# EAGLE design WenzelBox (EAGLE 5.12)
AUTHOR: Tobin Fricke; COMPANY: Max-Planck-Institut für Gravitationsphysik; DATE: 2013-01-23; REVISION: 2013-01-23; TITLE: WENZELBOX

## Sheet 1 of 4
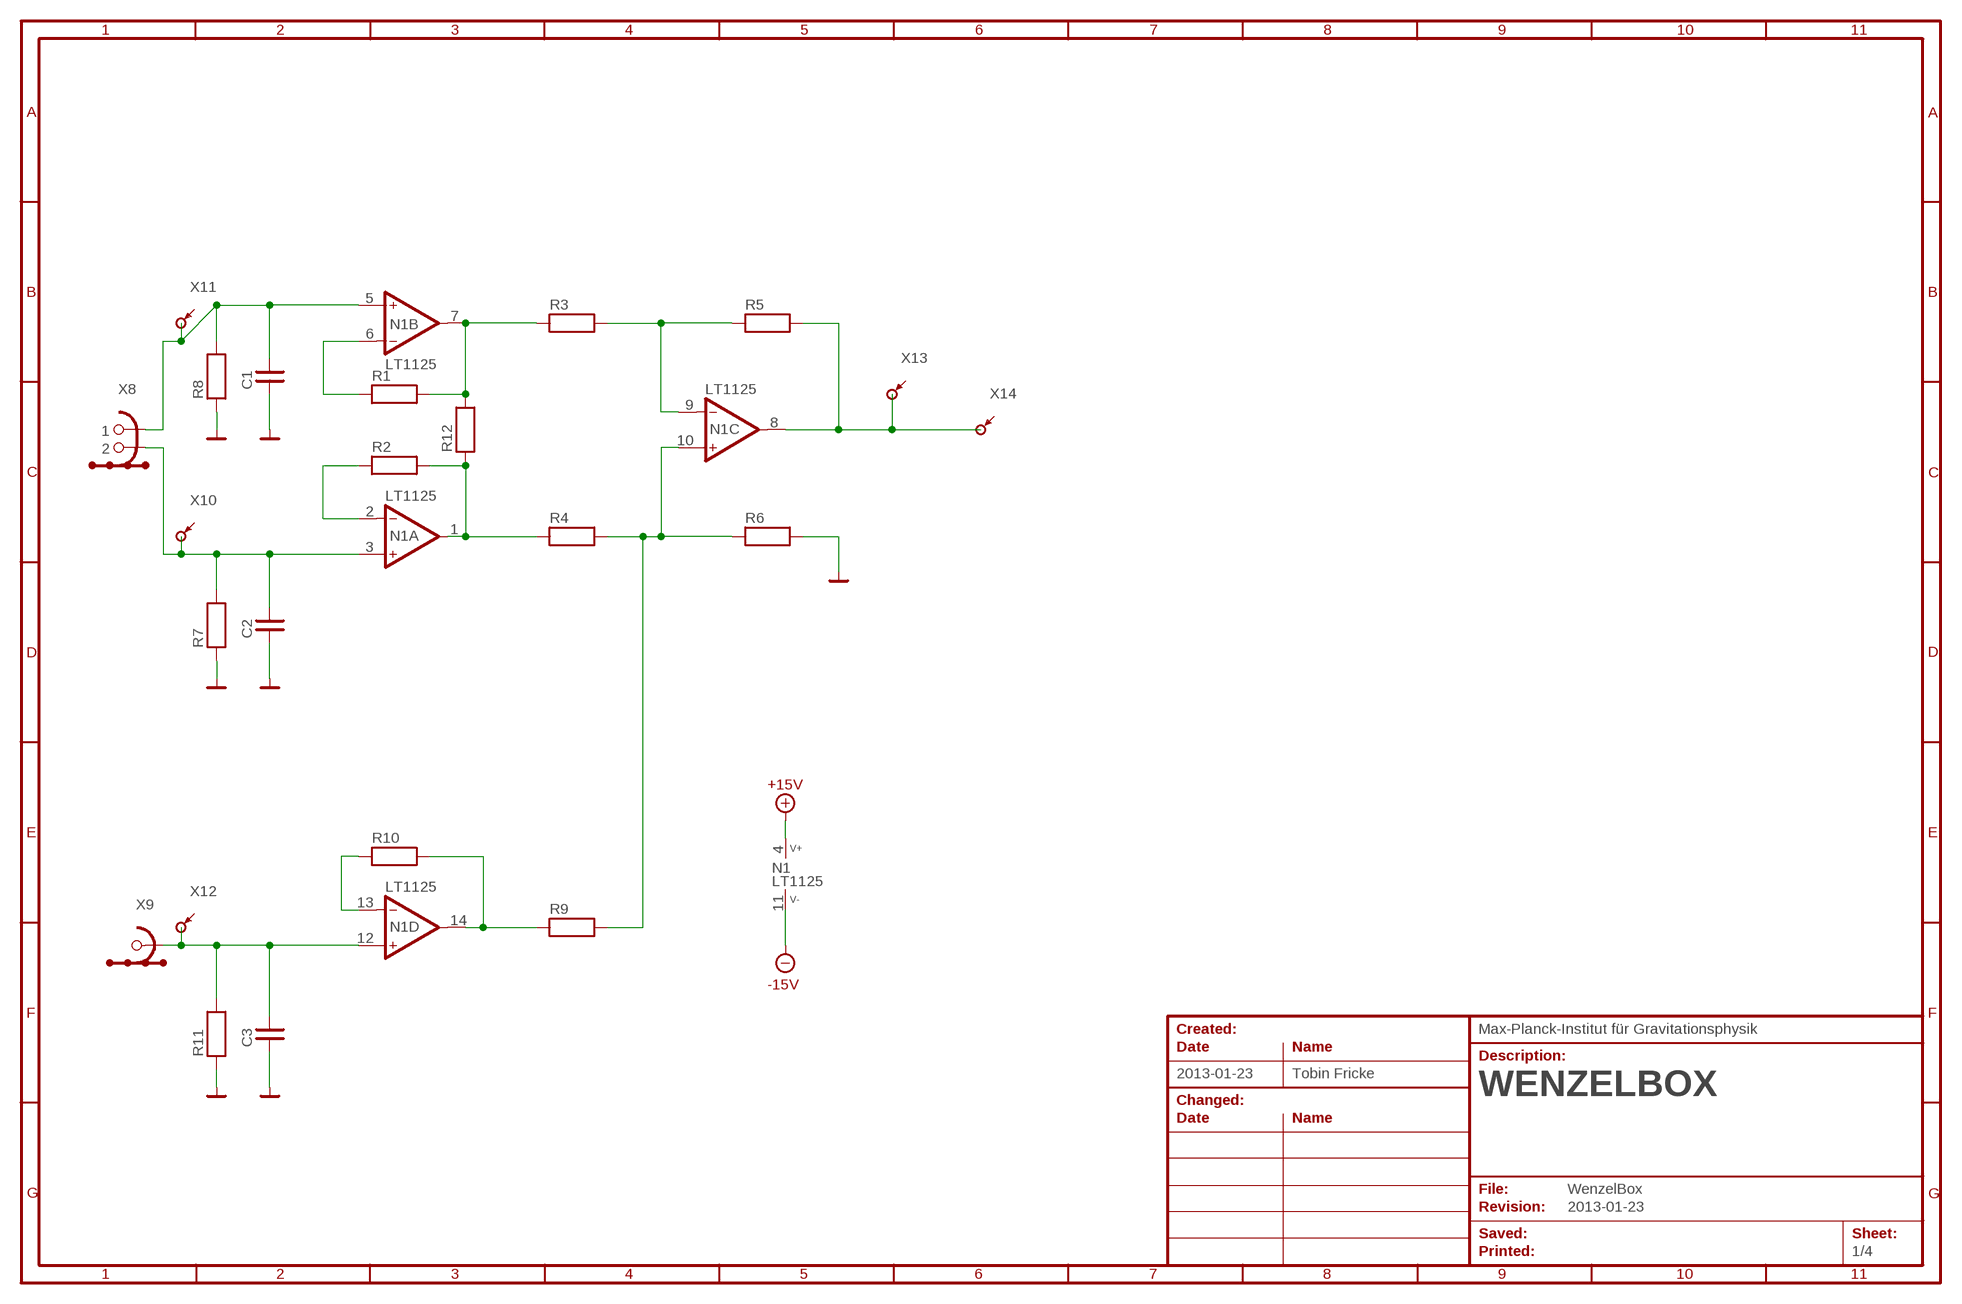
[diagram p0: schematic, sheet 1]
$2 (FRAME-A4-LANDSCAPE): SPICE: <ignore>

### Parts
C1  C  [C02N]
C2  C  [C02N]
C3  C  [C02N]
N1  LT1125  [DIP14L]
R1  R  [R04N]
R2  R  [R04N]
R3  R  [R04N]
R4  R  [R04N]
R5  R  [R04N]
R6  R  [R04N]
R7  R  [R04N]
R8  R  [R04N]
R9  R  [R04N]
R10  R  [R04N]
R11  R  [R04N]
R12  R  [R04N]
X8  XS02-4SN  [XS02-LEMO0B-HN]
X9  XS01-4S  [XS01-LEMO00-HN]
X10  XT-1.0METAL-N  [XT-1.0METAL-N]
X11  XT-1.0METAL-N  [XT-1.0METAL-N]
X12  XT-1.0METAL-N  [XT-1.0METAL-N]
X13  XT-1.0METAL-N  [XT-1.0METAL-N]
X14  XT-1.0METAL-N  [XT-1.0METAL-N]

### Nets
+15V: N1.4(P:V+) ; supply symbol labelled V+15V ; also sheet 4
-15V: N1.11(P:V-) ; supply symbol labelled V-15V ; also sheet 4
GND: C1.1 C2.1 C3.1 R6.2 R7.1 R8.1 R11.1 ; supply symbol labelled VG ; also sheet 4
N$4: N1.8(C:OUT) R5.2 X13.MP X14.MP
N$5: C1.2 N1.5(B:IN+) R8.2 X8.1 X11.MP
N$6: C2.2 N1.3(A:IN+) R7.2 X8.2 X10.MP
N$7: N1.2(A:IN-) R2.1
N$8: N1.1(A:OUT) R2.2 R4.1 R12.1
N$9: N1.7(B:OUT) R1.2 R3.1 R12.2
N$10: N1.6(B:IN-) R1.1
N$11: N1.14(D:OUT) R9.1 R10.2
N$13: N1.9(C:IN-) R3.2 R5.1
N$14: N1.10(C:IN+) R4.2 R6.1 R9.2
N$16: N1.13(D:IN-) R10.1
N$17: C3.2 N1.12(D:IN+) R11.2 X9.SIG X12.MP
Unconnected: X8.GND@1(GND) X8.GND@2(GND) X8.GND@3(GND) X8.GND@4(GND) X9.GND@1(GND) X9.GND@2(GND) X9.GND@3(GND) X9.GND@4(GND)

## Sheet 2 of 4
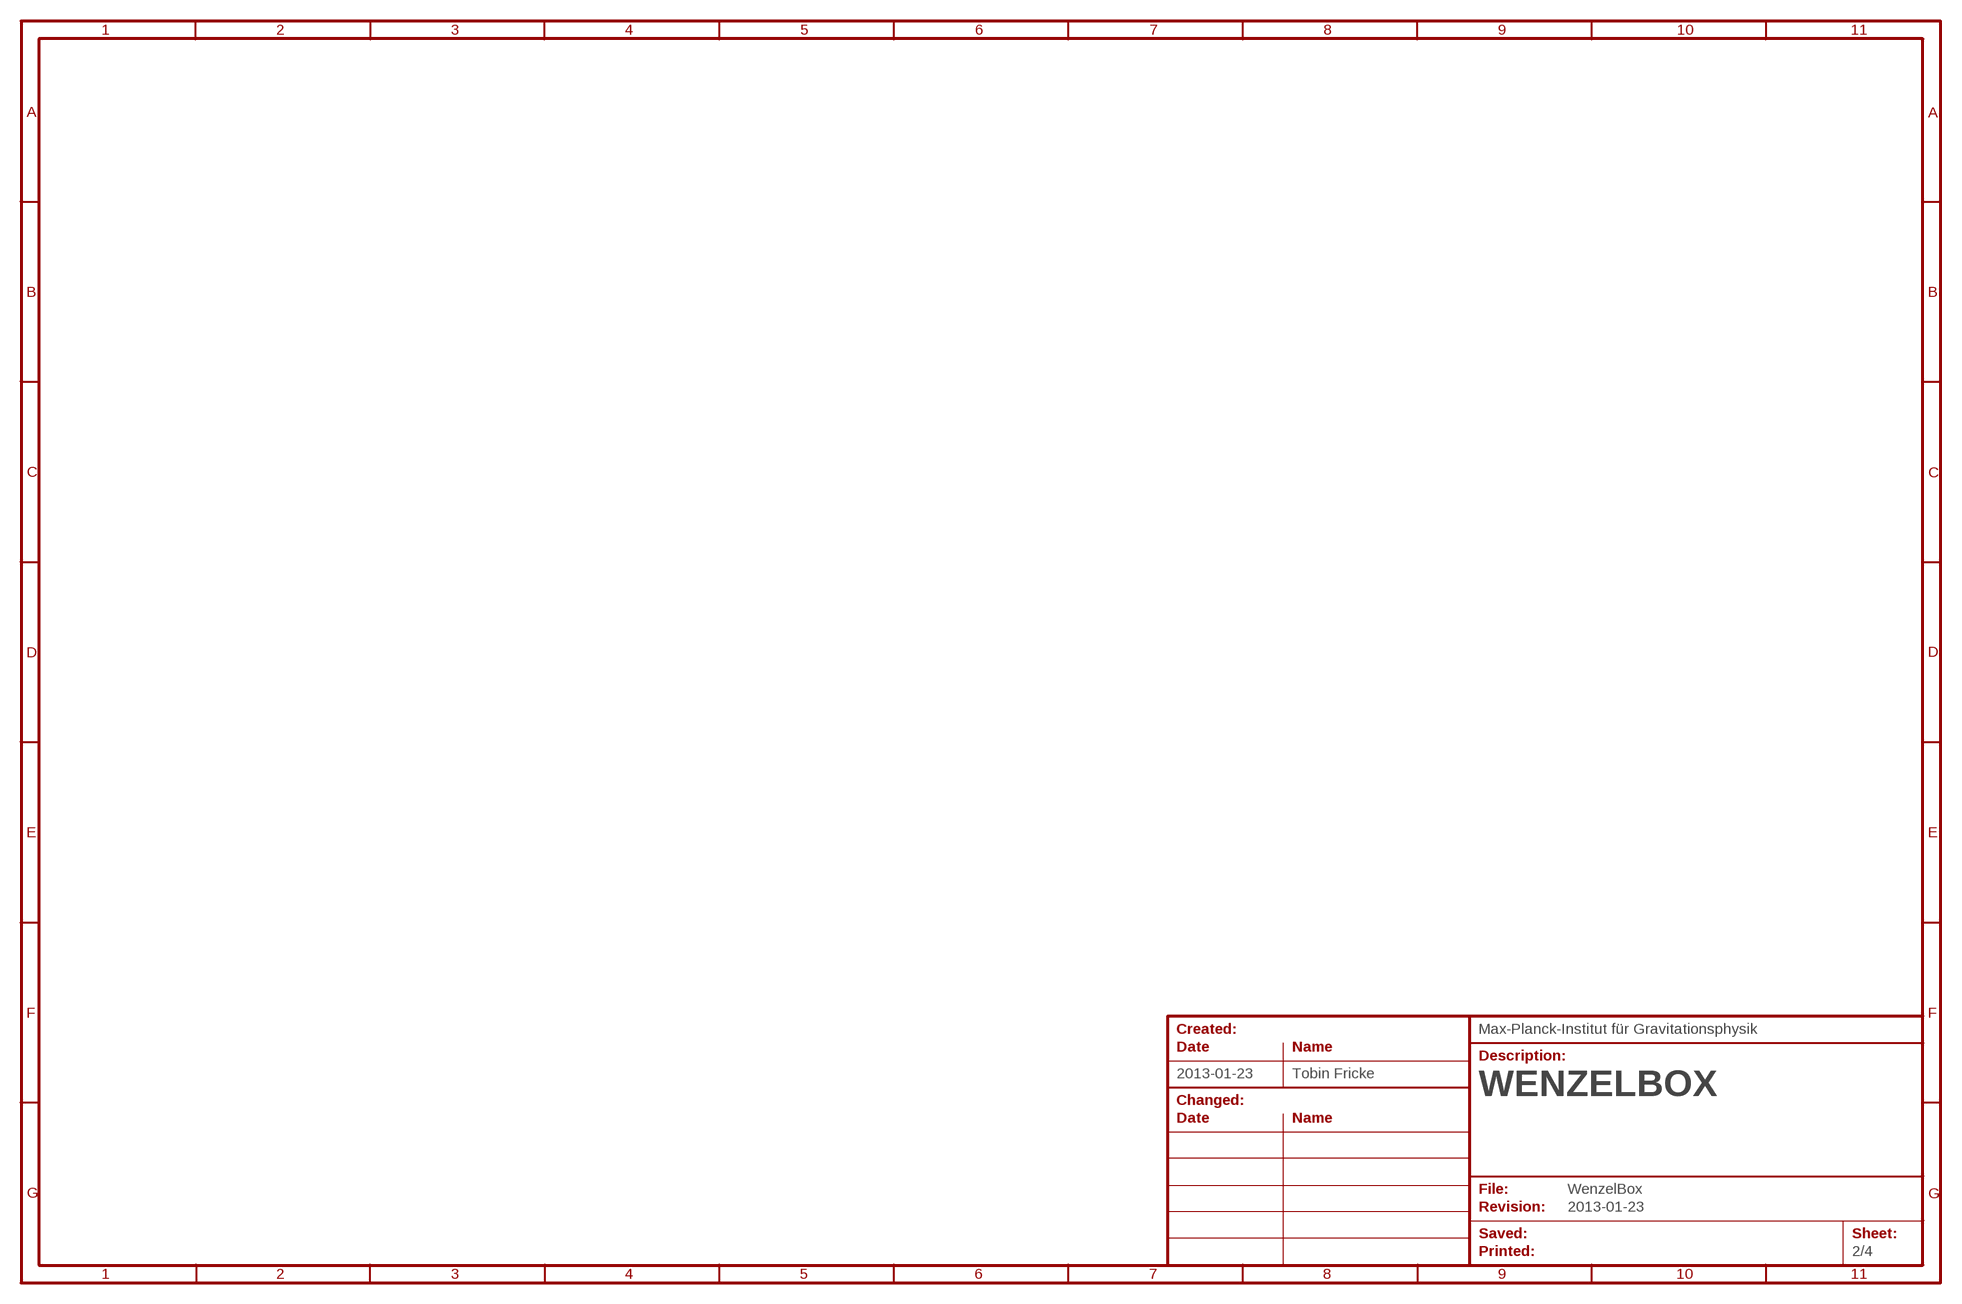
[diagram p1: schematic, sheet 2]
$3 (FRAME-A4-LANDSCAPE): SPICE: <ignore>

## Sheet 3 of 4
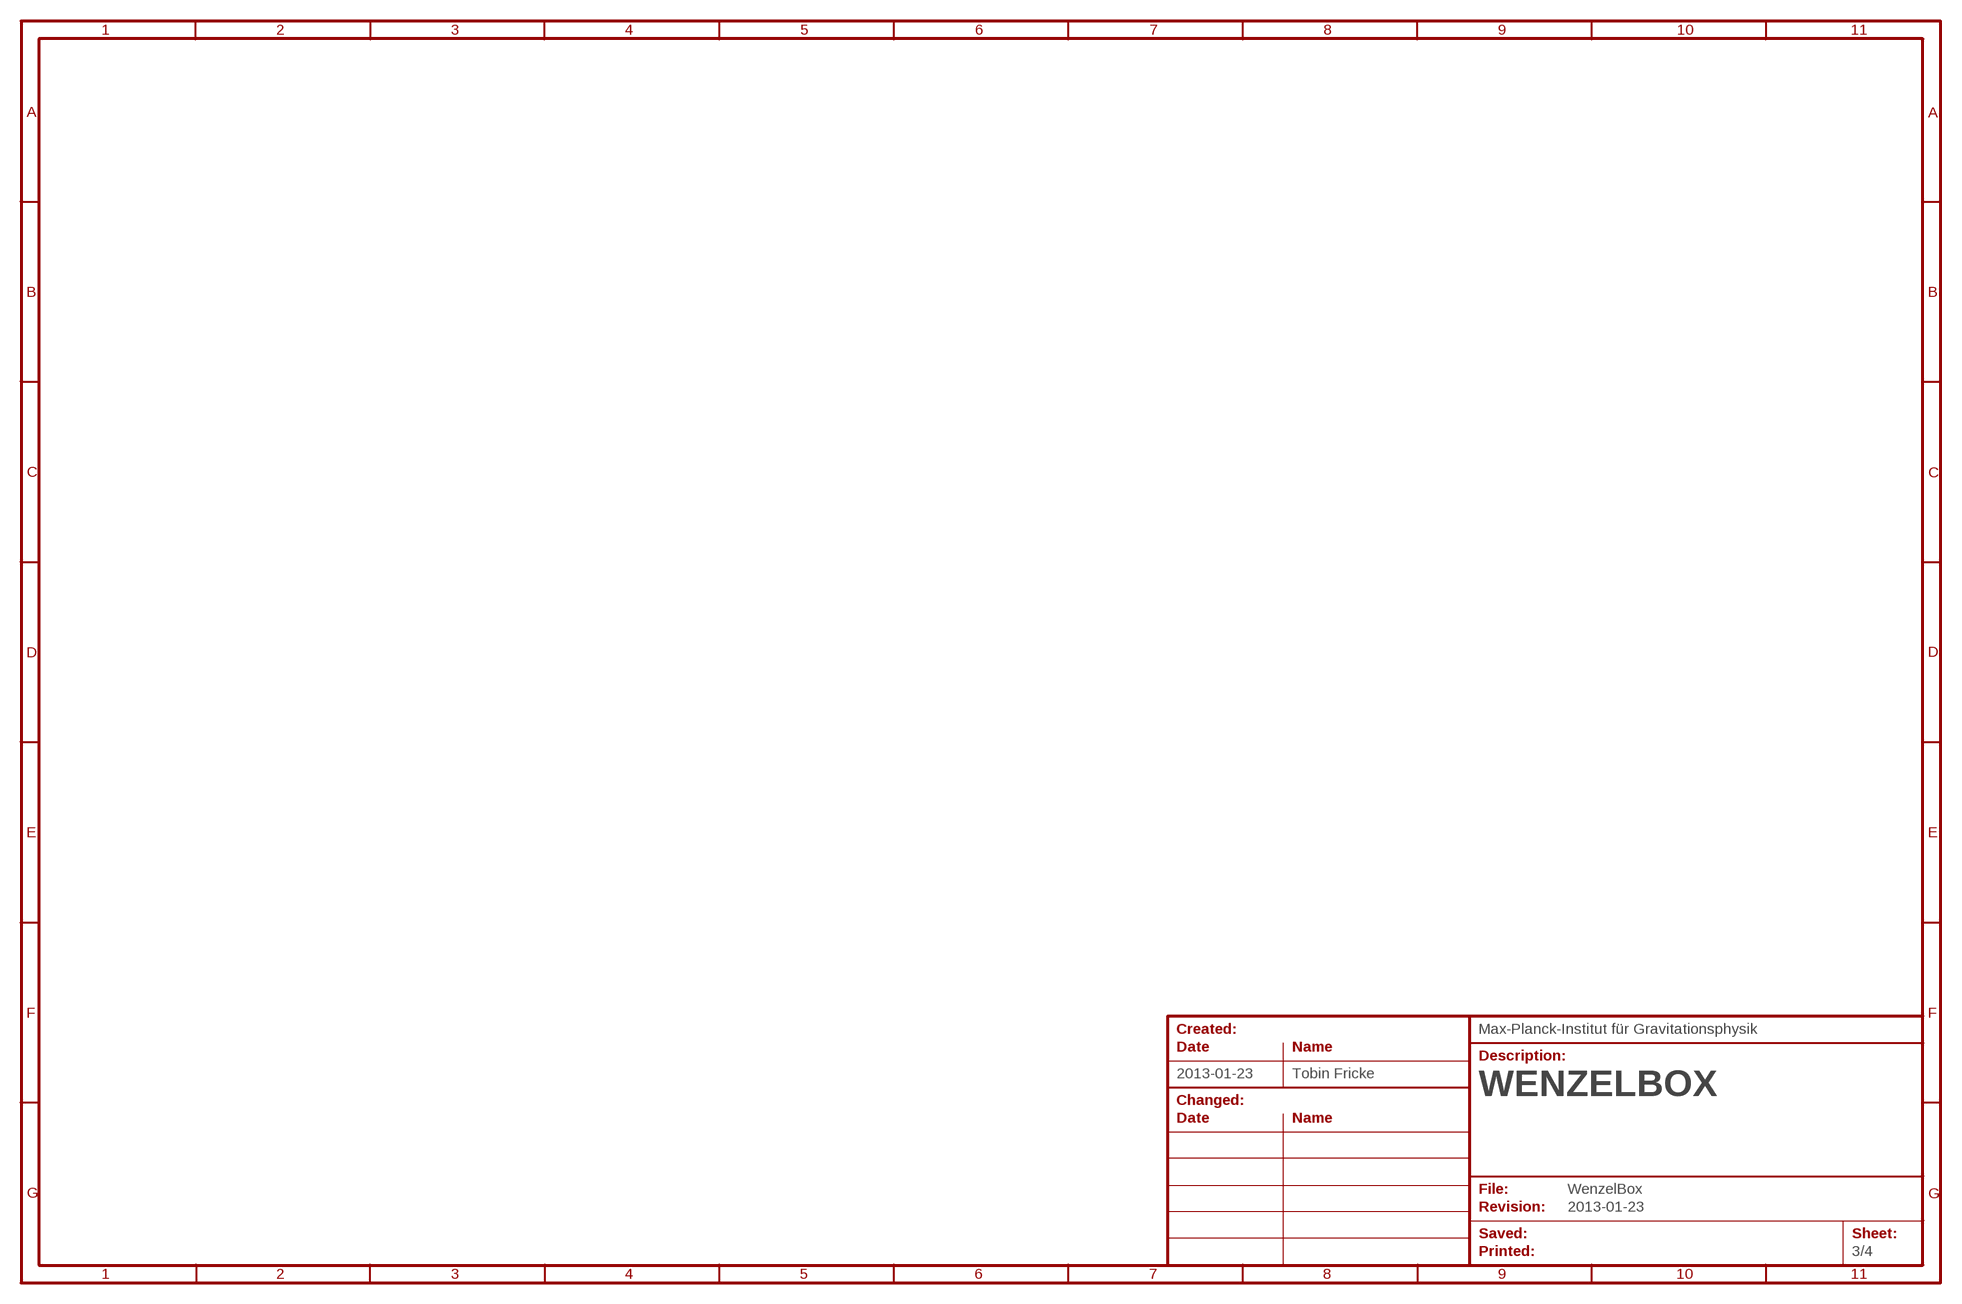
[diagram p2: schematic, sheet 3]
$4 (FRAME-A4-LANDSCAPE): SPICE: <ignore>

## Sheet 4 of 4
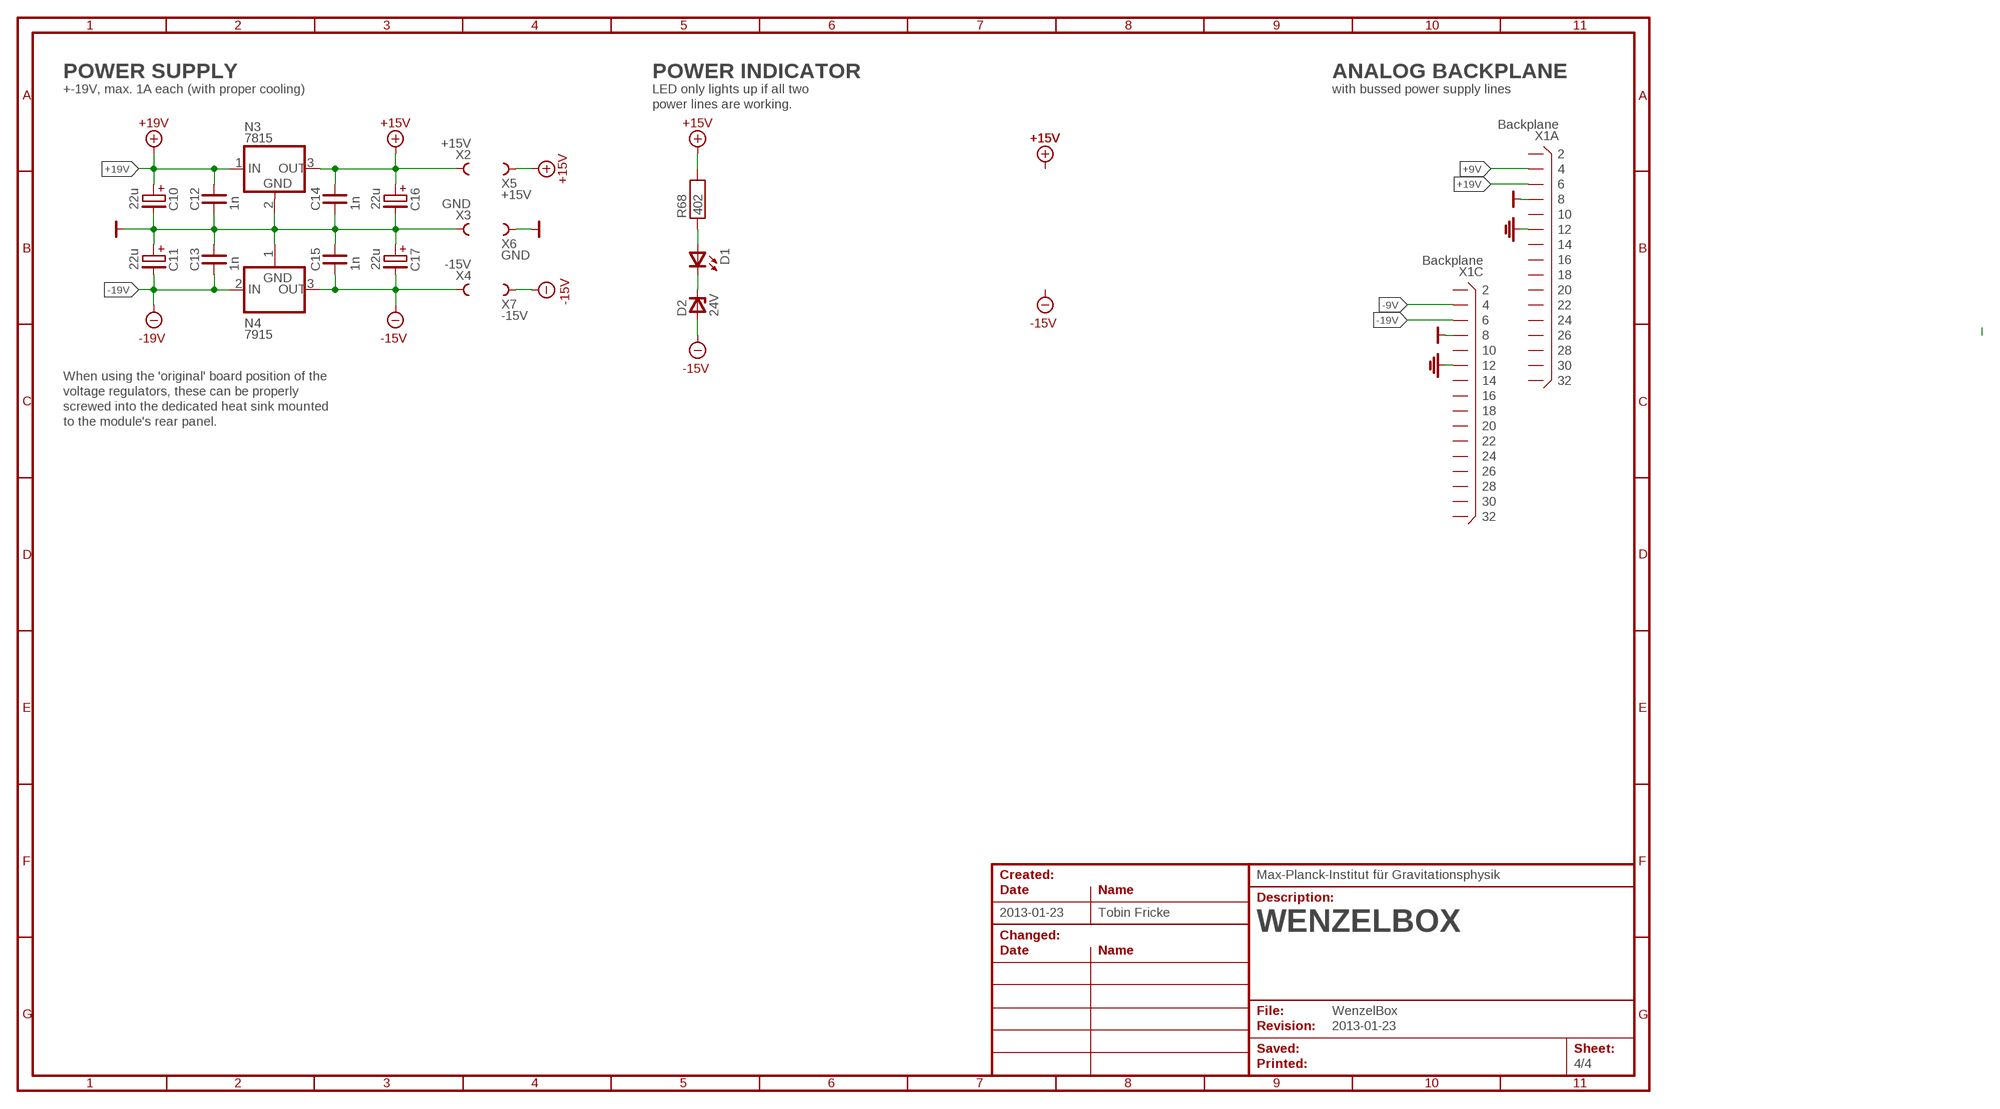
[diagram p3: schematic, sheet 4]
$1 (FRAME-A4-LANDSCAPE): SPICE: <ignore>

### Parts
C10  22u  CE02D  [CE02D]
C11  22u  CE02D  [CE02D]
C12  1n  C01N  [C01N]
C13  1n  C01N  [C01N]
C14  1n  C01N  [C01N]
C15  1n  C01N  [C01N]
C16  22u  CE02D  [CE02D]
C17  22u  CE02D  [CE02D]
D1  DL03-ANGLED1-L  [DL03-ANGLED1-L]
D2  24V  DZ04N  [DZ04N]
N3  7815  [TO220N]
N4  7915  [TO220N]
R68  402  R04N  [R04N]
X1  Backplane  XB32-AC-GEO  [X32-BACK-GEO]
X2  +15V  XP  [XT-0.8CERAM-N]
X3  GND  XP  [XT-0.8CERAM-N]
X4  -15V  XP  [XT-0.8CERAM-N]
X5  +15V  XP  [XT-0.8CERAM-N]
X6  GND  XP  [XT-0.8CERAM-N]
X7  -15V  XP  [XT-0.8CERAM-N]

### Nets
+9V: X1.A4
+15V: C14.2 C16.+ N3.3(OUT) R68.2 X2.MP X5.MP ; supply symbol labelled V+15V ; also sheet 1
+19V: C10.+ C12.2 N3.1(IN) X1.A6 ; supply symbol labelled V+19V
-9V: X1.C4
-15V: C15.1 C17.- D2.A N4.3(OUT) X4.MP X7.MP ; supply symbol labelled V-15V ; also sheet 1
-19V: C11.- C13.1 N4.2(IN) X1.C6 ; supply symbol labelled V-19V
GND: C10.- C11.+ C12.1 C13.2 C14.1 C15.2 C16.- C17.+ N3.2(GND) N4.1(GND) X1.A8 X1.C8 X3.MP X6.MP ; supply symbol labelled VG ; also sheet 1
N$2: D1.A R68.1
N$3: D1.C D2.C
PE: X1.A12 X1.C12 ; supply symbol labelled VPE
Unconnected: X1.A2 X1.A10 X1.A14 X1.A16 X1.A18 X1.A20 X1.A22 X1.A24 X1.A26 X1.A28 X1.A30 X1.A32 X1.C2 X1.C10 X1.C14 X1.C16 X1.C18 X1.C20 X1.C22 X1.C24 X1.C26 X1.C28 X1.C30 X1.C32

### Notes on the sheet
- POWER SUPPLY | POWER INDICATOR | ANALOG BACKPLANE
- +-19V, max. 1A each (with proper cooling) | LED only lights up if all two | with bussed power supply lines
- power lines are working.
- When using the 'original' board position of the
- voltage regulators, these can be properly
- screwed into the dedicated heat sink mounted
- to the module's rear panel.

## Library data of the parts
C1-C3 C12-C15 = miscs:C: Capacitor, bipolar _____ Supported SPICE attributes: VALUE, VOLTAGE, CPARALLEL, LSERIES, RLSHUNT, RPARALLEL, RSERIES (A detailed description of these parameters can be found in the library spice.lbr) _____ References (PDF files, electronics workshop server): WIMA FKP 02 <http://elektronik.aei.uni-hannover.de:3000/datasheets/capacitors/wima-fkp02.pdf> (polypropylene film capacitors, 0.1" spacing) WIMA FKP 2 <http://elektronik.aei.uni-hannover.de:3000/datasheets/capacitors/wima-fkp2.pdf> (polypropylene film capacitors, 0.2" spacing) WIMA FKS 2 <http://elektronik.aei.uni-hannover.de:3000/datasheets/capacitors/wima-fks2.pdf> (polyester film capacitors, 0.2" spacing) WIMA MKP 2 <http://elektronik.aei.uni-hannover.de:3000/datasheets/capacitors/wima-mkp2.pdf> (polypropylene film capacitors, 0.2" spacing) WIMA MKS 02 <http://elektronik.aei.uni-hannover.de:3000/datasheets/capacitors/wima-mks02.pdf> (polyester film capacitors, 0.1" spacing) WIMA MKS 2 <http://elektronik.aei.uni-hannover.de:3000/datasheets/capacitors/wima-mks2.pdf> (polyester film capacitors, 0.2" spacing) Kemet ceramics <http://elektronik.aei.uni-hannover.de:3000/datasheets/capacitors/kemet-ceramics.pdf> (multilayer ceramic leaded capacitors) Vishay ceramics HV <http://elektronik.aei.uni-hannover.de:3000/datasheets/capacitors/vishay-ceramic-hv.pdf> (multilayer ceramic leaded capacitors, high voltage) LCR polystyrene <http://elektronik.aei.uni-hannover.de:3000/datasheets/capacitors/lcr-polystyrene.pdf> (polystyrene radial capacitors, 0.2" spacing); SPICE: <IDEALMODEL>\n<name:C> <pin:A.1> <pin:A.2> <autovalue><voltage: ic=>\n\n<REALMODEL>\n<name:C> <pin:A.1> <pin:A.2> <autovalue><voltage: ic=><rseries: rser=><lseries: lser=><rparallel: rpar=><cparallel: cpar=><rlshunt: rlshunt=>
C10 C11 C16 C17 = miscs:CE: Electrolytic capacitor, unipolar _____ SPICE implementation as a bipolar capacitor with the supported attributes: VALUE, VOLTAGE, CPARALLEL, LSERIES, RLSHUNT, RPARALLEL, RSERIES (A detailed description of these parameters can be found in the library spice.lbr); SPICE: <IDEALMODEL>\n<name:C> <pin:A.+> <pin:A.-> <autovalue><voltage: ic=>\n\n<REALMODEL>\n<name:C> <pin:A.+> <pin:A.-> <autovalue><voltage: ic=><rseries: rser=><lseries: lser=><rparallel: rpar=><cparallel: cpar=><rlshunt: rlshunt=>
D1 = optos:DL: LED _____ The LED colour can be changed with the attribute COLOR.; IGNOREVALUE: 1
D2 = diodes:DZ: Zener diode; VALUE: DZ
N1 = opamps:LT1125: LT1125: Quad low noise precision opamp (Linear Technology) ±15V, ±20mA, 30nA bias 140µV offset, 8MHz UGF, 5.5nV/rt(Hz) noise _____ References: - PDF datasheet <http://elektronik.aei.uni-hannover.de:3000/datasheets/opamps/opamps/lt1125.pdf> (electronics workshop server) - Manufacturer's link <http://www.linear.com/product/lt1125> (Linear Technology website) - Internet search <http://www.google.de/search?q=lt1125> (Google results) _____ Supported SPICE subcircuits: LT1124 (not suited for noise analysis!) Supported LISO model: LT1124; LISO: <gate:A>\n op <name> <type> <pin:A.IN+> <pin:A.IN-> <pin:A.OUT>\n <warning:Power supply of <name> not included in simulation>\n\n<gate:B>\n op <name> <type> <pin:B.IN+> <pin:B.IN-> <pin:B.OUT>\n <warning:Power supply of <name> not included in simulation>\n\n<gate:C>\n op <name> <type> <pin:A.IN+> <pin:A.IN-> <pin:A.OUT>\n <warning:Power supply of <name> not included in simulation>\n\n<gate:D>\n op <name> <type> <pin:A.IN+> <pin:A.IN-> <pin:A.OUT>\n <warning:Power supply of <name> not included in simulation>\n\n<gate:P>\n <ignore>; SPICE: <gate:A>\n <name:X> <pin:A.IN+> <pin:A.IN-> <pin:P.V+> <pin:P.V-> <pin:A.OUT> <subckt:LT1124>\n\n<gate:B>\n <name:X> <pin:B.IN+> <pin:B.IN-> <pin:P.V+> <pin:P.V-> <pin:B.OUT> <subckt:LT1124>\n\n<gate:C>\n <name:X> <pin:A.IN+> <pin:A.IN-> <pin:P.V+> <pin:P.V-> <pin:A.OUT> <subckt:LT1124>\n\n<gate:D>\n <name:X> <pin:A.IN+> <pin:A.IN-> <pin:P.V+> <pin:P.V-> <pin:A.OUT> <subckt:LT1124>\n\n<gate:P>\n <ignore>; TYPE: LT1125
N3 = ics:78*: 78xx: Fixed positive voltage regulator Voltage can be selected with change technology; TYPE: 7815
N4 = ics:79*: 79xx: Fixed negative voltage regulator Voltage can be selected with change technology; TYPE: 7915
R1-R12 R68 = miscs:R: Resistor, European symbol _____ Supported SPICE attributes: VALUE (A detailed description of these parameters can be found in the library spice.lbr); SPICE: <name:R> <pin:A.1> <pin:A.2> <autovalue>
X1 = connectors:XB32-AC: Backplane connector 32 pins Used planes A+C; IGNOREVALUE: 1; SPICE: <ignore>
X2-X7 = connectors:XP: Pin (input/output); IGNOREVALUE: 1; SPICE: <ignore>
X8 = connectors:XS02-4S: Shielded connector, 2 pins, 4 shield pins; SPICE: <ignore>
X9 = connectors:XS01-4S: Shielded connector, 4 shield pins - LEMO 00 - SMA - Crimpterminal RG174/RG58; SPICE: <ignore>
X10-X14 = connectors:XT: Test point _____ The colour of insulated ceramic test pins can be changed with the attribute COLOR.; SPICE: <ignore>

## Board
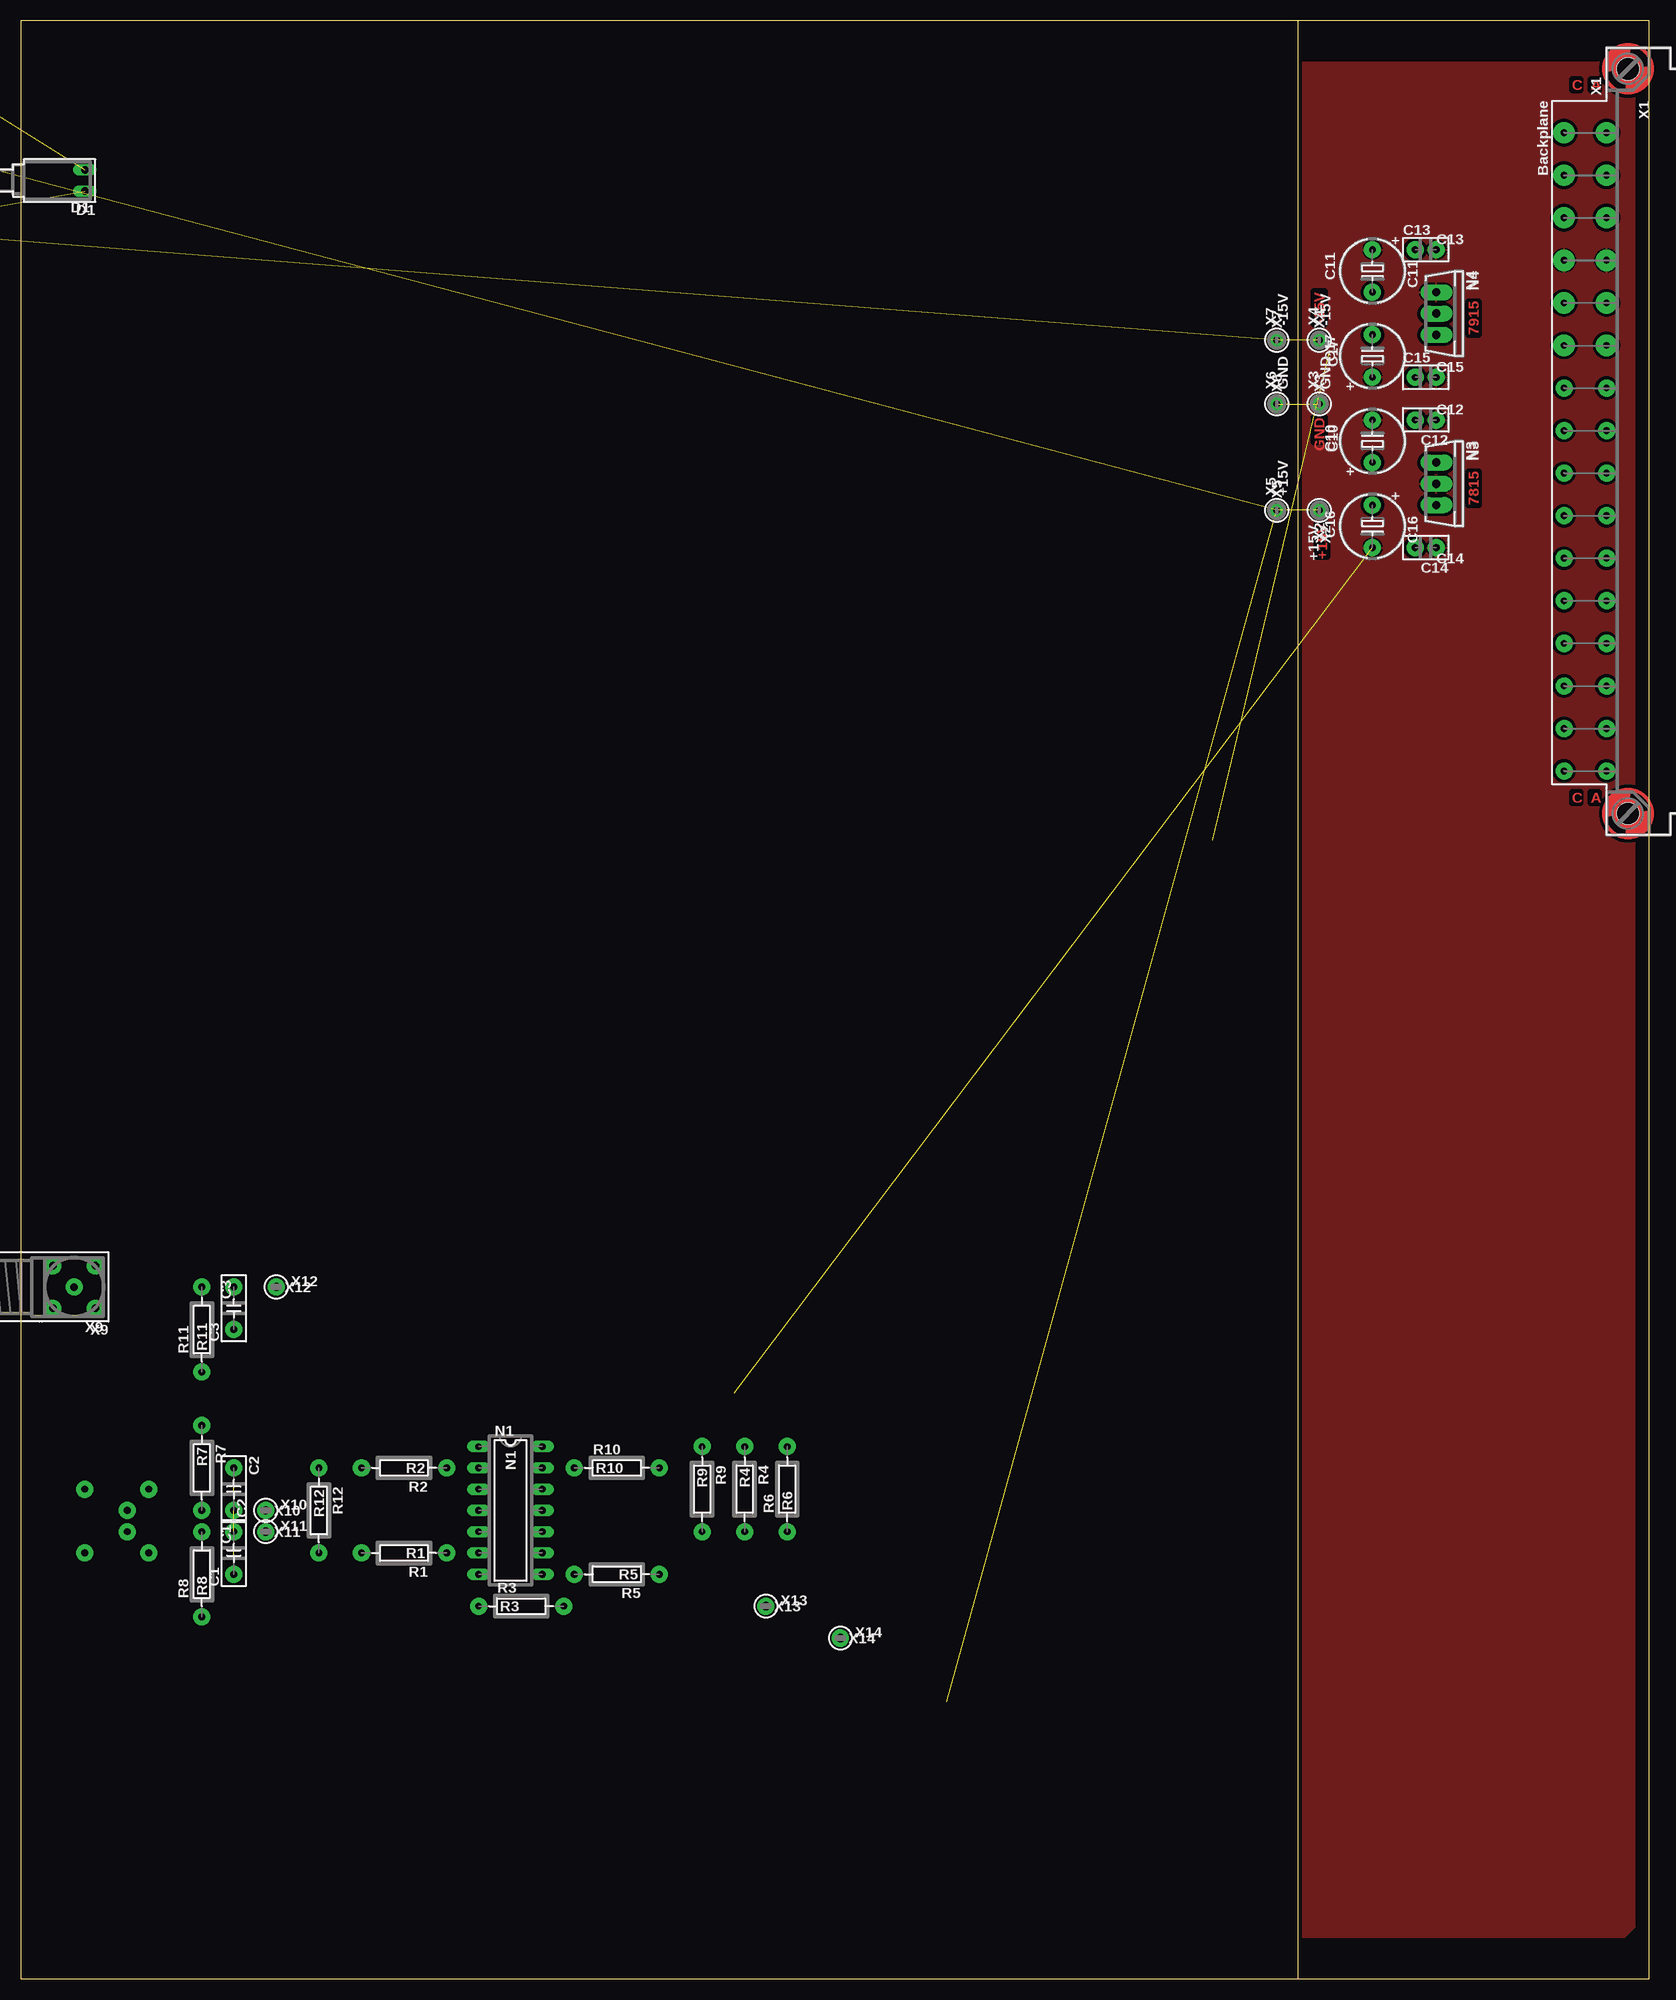
[diagram p4: board, top side]
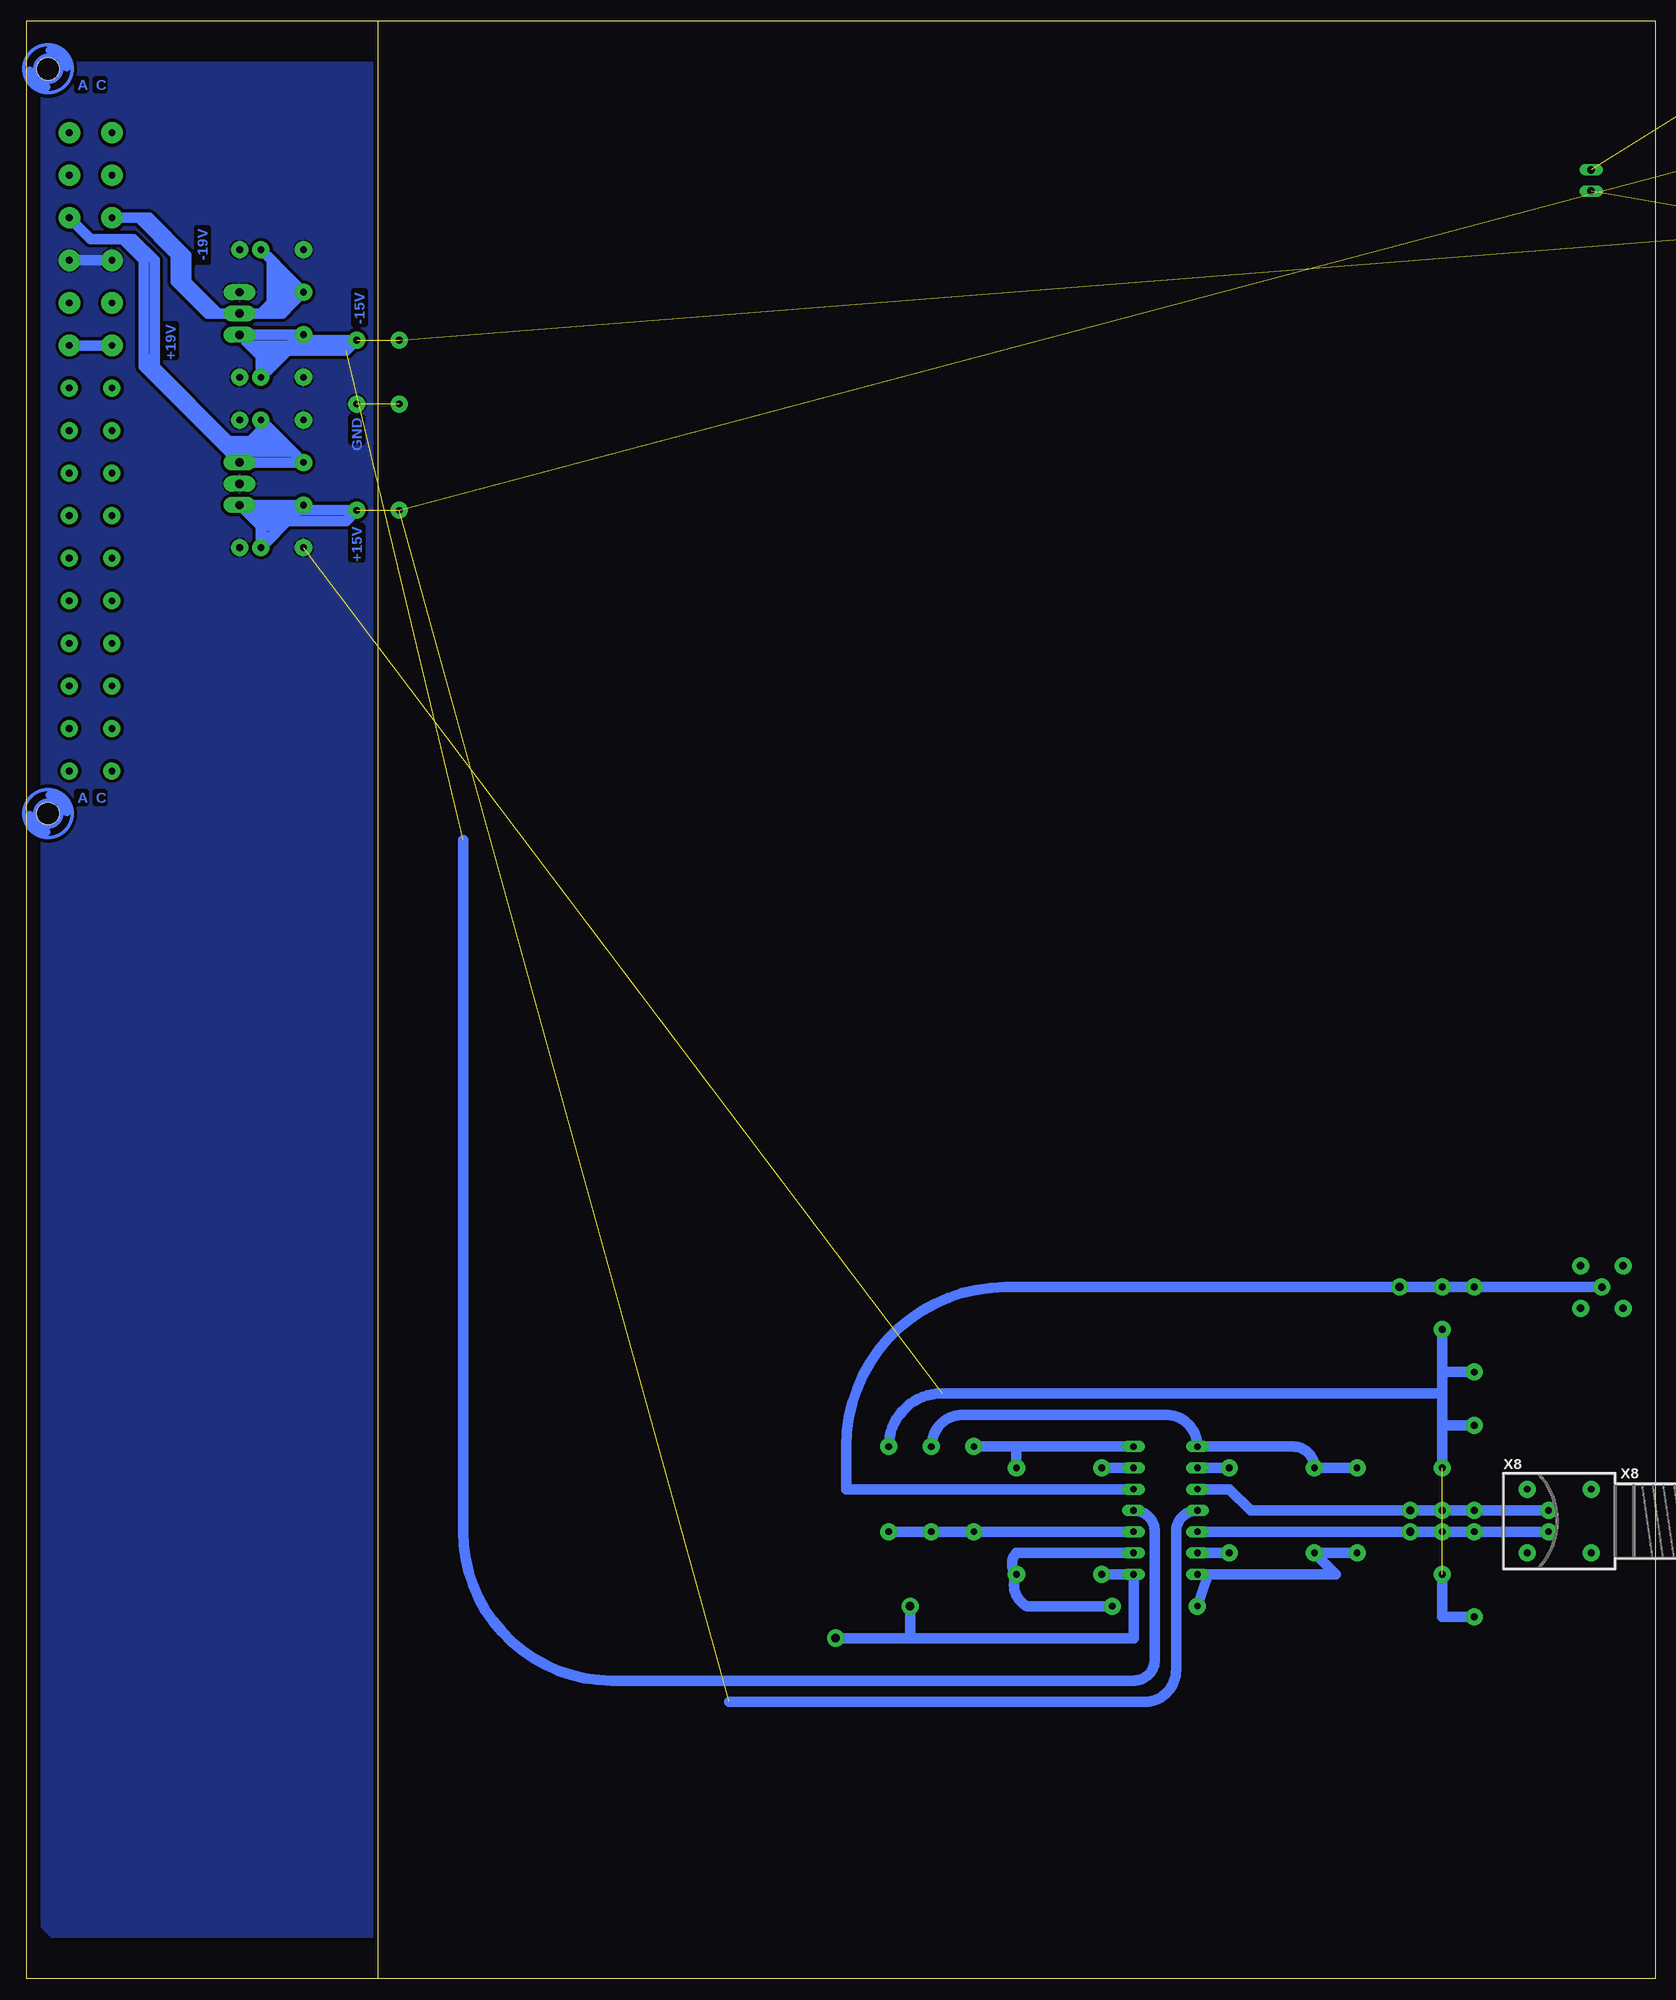
[diagram p5: board, bottom side, seen from below]

Size 194.31 x 233.68 mm. Coordinates in mm from the lower left corner, seen from the top.
Outline: 152.4,233.68 152.4,0
Copper layers (1*16): Top 0.035mm / dielectric 1.5mm / Bottom 0.035mm
Design rules "doublesided": minimum track width 0.2mm, minimum drill 0.8mm, track to track 0.2mm, track to pad 0.2mm, pad to pad 0.2mm, via to via 0.2mm, smd to smd 0mil, copper to edge 0.5mm, drill to drill 0.4mm, minimum pad ring 0.2mm, minimum via ring 0.2mm, stop-mask expansion 0.08mm, vias tented up to drill 0mil, thermal gap 0.2mm

### Footprints (pad centres in the part's own frame; a part is rotated, then mirrored left to right if it is on the bottom)
C02N = drill 0.813 pad 2.032 round: 1 -2.54,0; 2 2.54,0
CE02D = drill 0.813 pad 2.032 round: + -2.54,0; - 2.54,0
C01N = drill 0.813 pad 2.032 round: 1 -1.27,0; 2 1.27,0
DL03-ANGLED1-L = drill 0.889 pad 1.397 long: A 1.27,0; C -1.27,0
DZ04N = drill 0.813 pad 2.032 round: A -5.08,0; C 5.08,0
DIP14L = drill 0.813 pad 1.397 long: 1 -7.62,-3.81; 2 -5.08,-3.81; 3 -2.54,-3.81; 4 0,-3.81; 5 2.54,-3.81; 6 5.08,-3.81; 7 7.62,-3.81; 8 7.62,3.81; 9 5.08,3.81; 10 2.54,3.81; 11 0,3.81; 12 -2.54,3.81; 13 -5.08,3.81; 14 -7.62,3.81
TO220N = drill 0.991 pad 1.905 long: 1 -2.54,0; 2 0,0; 3 2.54,0
R04N = drill 0.813 pad 2.032 round: 1 -5.08,0; 2 5.08,0
X32-BACK-GEO = drill 0.813 pad 2.54 round: A2 -36.83,-2.54; A4 -31.75,-2.54; A6 -26.67,-2.54; A8 -21.59,-2.54; A10 -16.51,-2.54; A12 -11.43,-2.54; C2 -36.83,-7.62; C4 -31.75,-7.62; C6 -26.67,-7.62; C8 -21.59,-7.62; C10 -16.51,-7.62; C12 -11.43,-7.62 | drill 0.813 pad 2.032 round: A14 -6.35,-2.54; A16 -1.27,-2.54; A18 3.81,-2.54; A20 8.89,-2.54; A22 13.97,-2.54; A24 19.05,-2.54; A26 24.13,-2.54; A28 29.21,-2.54; A30 34.29,-2.54; A32 39.37,-2.54; C14 -6.35,-7.62; C16 -1.27,-7.62; C18 3.81,-7.62; C20 8.89,-7.62; C22 13.97,-7.62; C24 19.05,-7.62; C26 24.13,-7.62; C28 29.21,-7.62; C30 34.29,-7.62; C32 39.37,-7.62 | hole 2.692: -44.45,0; 44.45,0
XT-0.8CERAM-N = drill 0.813 pad 2.032 round: MP 0,0
XS02-LEMO0B-HN = drill 0.813 pad 2.032 round: 1 -1.27,-1.27; 2 -1.27,1.27; GND@1 -3.81,-3.81; GND@2 3.81,-3.81; GND@3 3.81,3.81; GND@4 -3.81,3.81
XS01-LEMO00-HN = drill 0.889 pad 2.032 round: GND@1 -2.54,-2.54; GND@2 2.54,-2.54; GND@3 2.54,2.54; GND@4 -2.54,2.54; SIG 0,0
XT-1.0METAL-N = drill 0.991 pad 2.032 round: MP 0,0

### Placement (x,y rotation side)
C1  25.4,50.8 90 top
C2  25.4,58.42 270 top
C3  25.4,80.01 90 top
C10  161.29,183.52 90 top
C11  161.29,203.84 270 top
C12  167.64,186.06 180 top
C13  167.64,206.38 0 top
C14  167.64,170.81 180 top
C15  167.64,191.13 0 top
C16  161.29,173.35 270 top
C17  161.29,193.68 90 top
D1  7.62,214.63 90 top
D2  -16.51,208.28 180 top  (outside the outline)
N1  58.42,55.88 270 top
N3  168.91,178.44 270 top
N4  168.91,198.75 270 top
R1  45.72,50.8 180 top
R2  45.72,60.96 180 top
R3  59.69,44.45 0 top
R4  86.36,58.42 270 top
R5  71.12,48.26 180 top
R6  91.44,58.42 90 top
R7  21.59,60.96 270 top
R8  21.59,48.26 90 top
R9  81.28,58.42 270 top
R10  71.12,60.96 0 top
R11  21.59,77.47 90 top
R12  35.56,55.88 270 top
R68  -12.7,223.52 270 top  (outside the outline)
U$1  [CASE-GEO-ANALOG]  0,-13.97 0 top  (outside the outline)
U$2  [INFO-SMALL]  17.78,13.33 0 top
X1  191.77,183.52 270 top
X2  154.94,175.26 270 top
X3  154.94,187.96 90 top
X4  154.94,195.58 90 top
X5  149.86,175.26 90 top
X6  149.86,187.96 90 top
X7  149.86,195.58 90 top
X8  11.43,54.61 0 bottom
X9  6.35,82.55 180 top
X10  29.21,55.88 0 top
X11  29.21,53.34 0 top
X12  30.48,82.55 0 top
X13  88.9,44.45 0 top
X14  97.79,40.64 0 top

### Tracks (layer width: path | path; a pad name or v marks a point on that pad's centre or on a via)
+15V  (3 unrouted)
  Bottom 1.27: 167.64,174.62 166.37,173.35 | 166.37,173.35 166.37,172.09 | 163.83,173.35 165.1,172.09 | 162.56,174.62 163.83,173.35 | 165.1,172.09 166.37,172.09 | 163.83,173.35 166.37,173.35 | 162.56,174.62 167.64,174.62 | 167.64,174.62 N3.3 C16.+ | C16.+ 162.56,174.62 | 165.1,172.09 C14.2 166.37,172.09 | 160.66,175.26 C16.+ | 160.66,175.26 X2.MP 156.21,173.99 163.83,173.99 | 160.66,175.26 162.56,175.26 | N1.4 arc-90 57.15,53.34 57.15,36.83 arc90 60.96,33.02 110.49,33.02
+19V
  Bottom 1.27: 166.37,183.52 166.37,184.78 | 167.64,182.25 166.37,183.52 | 162.56,182.25 163.83,183.52 | 163.83,183.52 165.1,184.78 | 165.1,184.78 166.37,184.78 | 163.83,183.52 166.37,183.52 | 162.56,182.25 167.64,182.25 | 182.88,207.65 180.34,205.1 180.34,193.68 | 180.34,193.68 180.34,192.41 171.45,183.52 | 170.18,182.25 171.45,183.52 | 170.18,182.25 167.64,182.25 | 171.45,183.52 170.18,183.52 | 170.18,183.52 167.64,183.52 | 166.37,183.52 167.64,183.52 | 166.37,184.78 167.64,183.52 | 170.18,183.52 179.07,192.41 | 179.07,192.41 180.34,193.68 | 179.07,192.41 179.07,205.1 181.61,207.65 182.88,207.65 | 170.18,182.25 N3.1 C10.+ 162.56,182.25 | 166.37,184.78 C12.2 165.1,184.78 | X1.A6 186.69,207.65 182.88,207.65
-15V  (3 unrouted)
  Bottom 1.27: 167.64,194.94 166.37,193.68 | 166.37,193.68 166.37,192.41 | 163.83,193.68 165.1,192.41 | 162.56,194.94 163.83,193.68 | 162.56,194.94 167.64,194.94 | 163.83,193.68 166.37,193.68 | 165.1,192.41 166.37,192.41 | 167.64,194.94 N4.3 C17.- | 166.37,192.41 C15.1 165.1,192.41 | C17.- 162.56,194.94 | 160.66,195.58 C17.- | 160.66,195.58 X4.MP 156.21,194.31 163.83,194.31 | 160.66,195.58 162.56,195.58 | N1.11 arc90 59.69,53.34 59.69,38.1 arc90 62.23,35.56 124.46,35.56 arc90 142.24,53.34 142.24,135.89
-19V
  Bottom 1.27: 162.56,200.03 163.83,198.75 | 163.83,198.75 165.1,198.75 | 165.1,198.75 166.37,198.75 | 162.56,202.56 163.83,203.84 | 163.83,203.84 165.1,205.1 | 162.56,202.56 162.56,200.03 | 163.83,198.75 163.83,203.84 | 165.1,205.1 165.1,200.03 | 165.1,198.75 165.1,200.03 | 166.37,198.75 165.1,200.03 | 171.45,198.75 175.26,202.56 | 171.45,198.75 172.72,198.75 175.26,201.29 | 175.26,202.56 175.26,201.29 | 175.26,201.29 176.53,202.56 176.53,205.74 | 166.37,198.75 N4.2 171.45,198.75 | 165.1,205.1 C13.1 | 162.56,202.56 C11.- 162.56,200.03 | 180.97,210.19 X1.C6 | 176.53,205.74 180.97,210.19 | 175.26,202.56 175.26,204.47 | 175.26,204.47 176.53,205.74 | 175.26,204.47 175.26,205.74 179.71,210.19 180.97,210.19
GND  (3 unrouted)
  Bottom 1.27: X1.C8 X1.A8 | C2.1 25.4,66.04 | 25.4,66.04 R7.1 | C1.1 25.4,43.18 R8.1 | 25.4,72.39 C3.1 | 25.4,72.39 R11.1 | 25.4,66.04 25.4,69.85 | 25.4,69.85 25.4,72.39 | R6.2 arc90 85.09,69.85 25.4,69.85
  pour Top (isolate 0.381, rank 5): 152.4,233.68 152.4,0 194.31,0 194.31,233.68
  pour Bottom (isolate 0.381, rank 5): 152.4,233.68 152.4,0 194.31,0 194.31,233.68
N$2  (1 unrouted)
N$3  (1 unrouted)
N$4
  Bottom 1.27: R5.2 N1.8 62.23,40.64 88.9,40.64 | 88.9,40.64 X14.MP | 88.9,40.64 X13.MP
N$5
  Bottom 1.27: N1.5 X11.MP C1.2 R8.2 X8.1
N$6
  Bottom 1.27: N1.3 50.8,58.42 48.26,55.88 X10.MP C2.2 R7.2 X8.2
N$7
  Bottom 1.27: R2.1 N1.2
N$8
  Bottom 1.27: R12.1 R2.2 arc-90 43.18,63.5 N1.1 arc-90 58.42,67.31 82.55,67.31 arc-90 R4.1
N$9
  Bottom 1.27: 53.34,48.26 38.1,48.26 R1.2 R12.2 | 53.34,48.26 N1.7 | 53.34,48.26 R3.1
N$10
  Bottom 1.27: R1.1 N1.6
N$11
  Bottom 1.27: N1.14 76.2,63.5 | 76.2,63.5 R9.1 | 76.2,63.5 R10.2
N$13
  Bottom 1.27: R3.2 74.93,44.45 arc90 R5.1 arc90 76.2,50.8 N1.9
N$14
  Bottom 1.27: N1.10 R9.2 R4.2 R6.1
N$16
  Bottom 1.27: N1.13 R10.1
N$17
  Bottom 1.27: X9.SIG R11.2 C3.2 X12.MP 77.47,82.55 arc-90 96.52,63.5 96.52,58.42 N1.12
PE
  Bottom 1.27: X1.C12 X1.A12

### Text on the board
Top: C | A | -15V | 7915 | GND | 7815 | +15V | C | A
Bottom: C | A | -19V | -15V | +19V | GND | +15V | C | A